# EAGLE design MacroStepper_v3.0 (EAGLE 9.6.2)
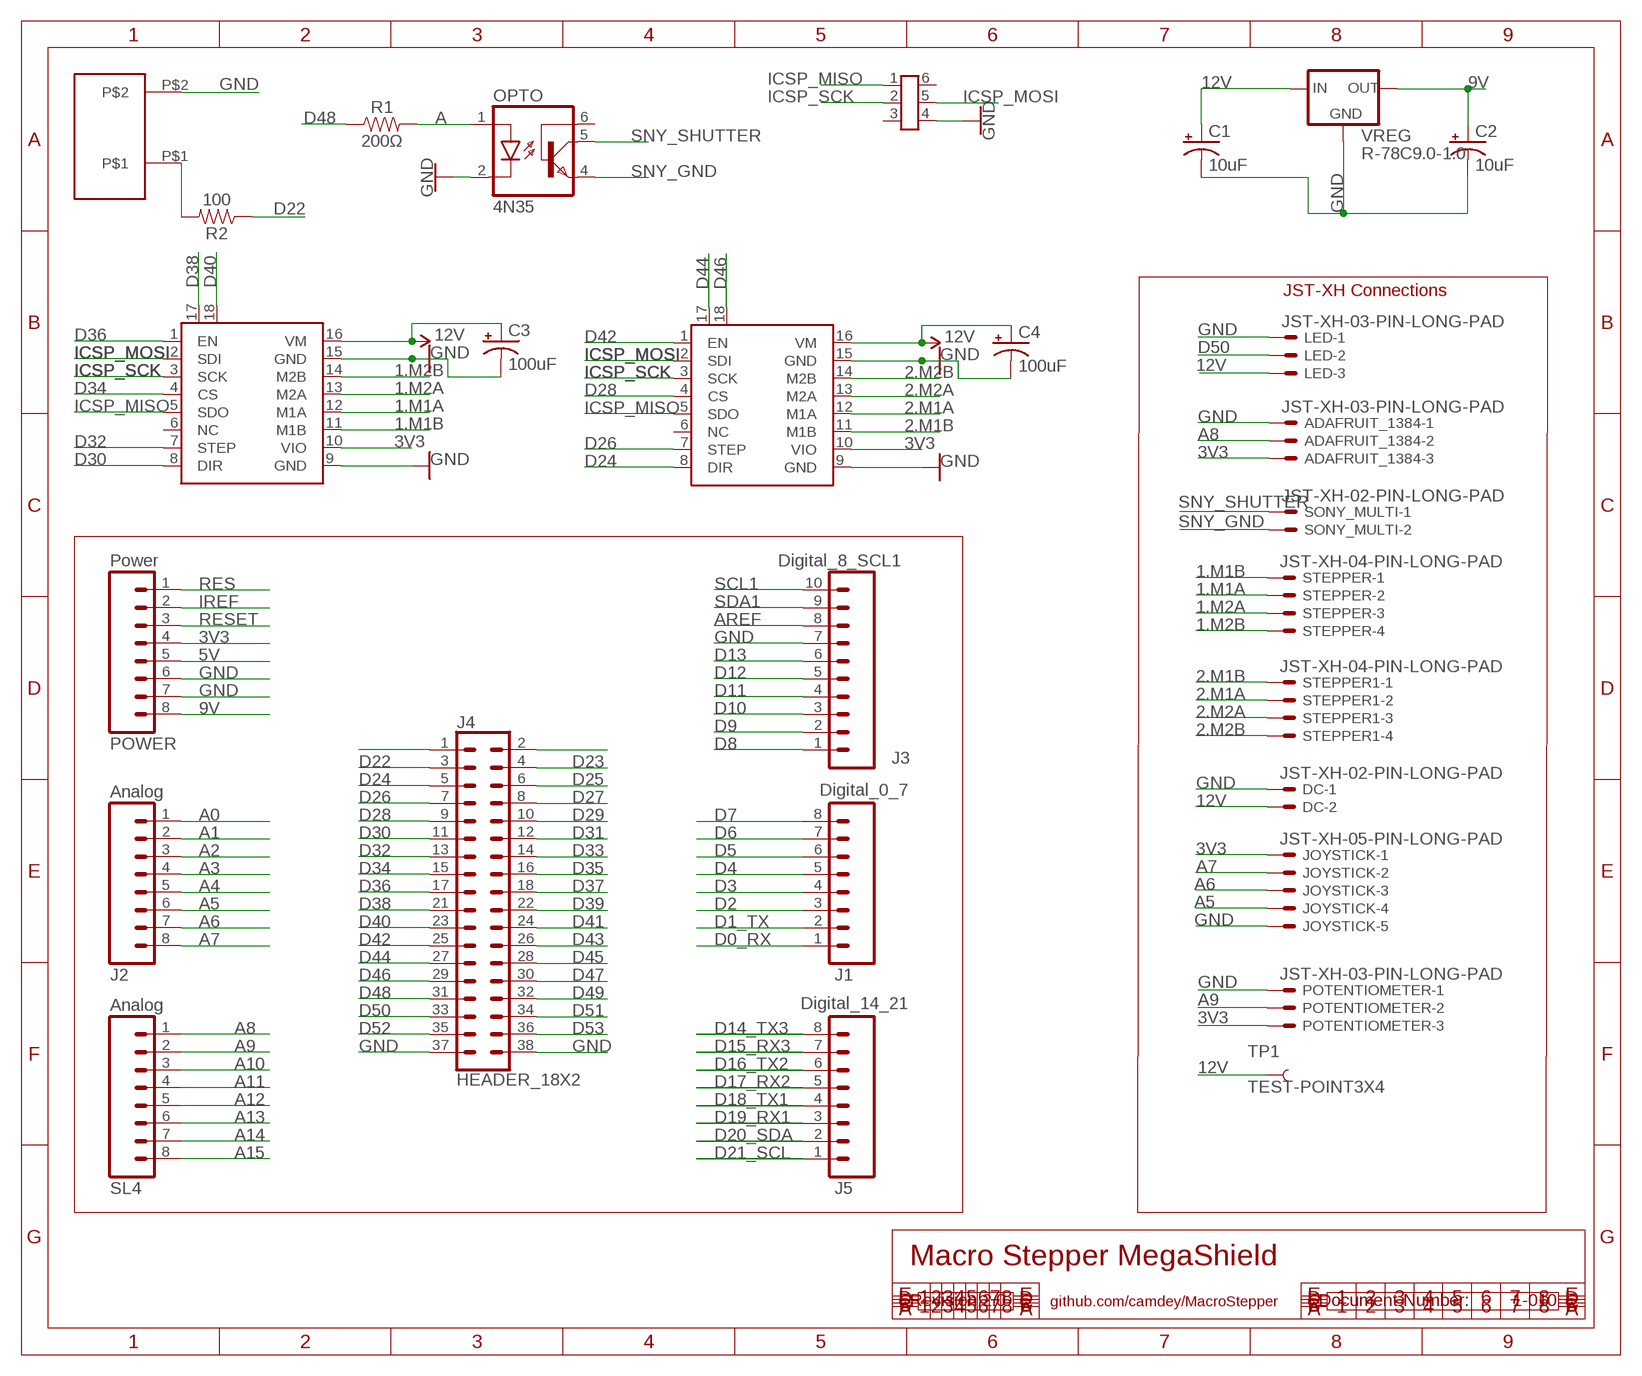
[diagram p0: schematic, sheet 1]

## Parts
ADAFRUIT_1384  JST-XH-03-PIN-LONG-PAD  [JST-XH-03-PACKAGE-LONG-PAD]
C1  10uF  10UF-POLAR-RADIAL-2.5MM-25V-20%  [CPOL-RADIAL-2.5MM-5MM]
C2  10uF  10UF-POLAR-RADIAL-2.5MM-25V-20%  [CPOL-RADIAL-2.5MM-5MM]
C3  100uF  100UF-POLAR-RADIAL-2.5MM-25V-20%  [CPOL-RADIAL-2.5MM-6.5MM]
C4  100uF  100UF-POLAR-RADIAL-2.5MM-25V-20%  [CPOL-RADIAL-2.5MM-6.5MM]
DC  JST-XH-02-PIN-LONG-PAD  [JST-XH-02-PACKAGE-LONG-PAD]
ICSP  MEGA_ICSP  [MEGA_ICSP]
J1  Digital_0_7  M08  [1X08]
J2  Analog  M08  [1X08]
J3  Digital_8_SCL1  M10"  [1X10]
J4  HEADER_18X2  [2X18]
J5  Digital_14_21  M08  [1X08]
JOYSTICK  JST-XH-05-PIN-LONG-PAD  [JST-XH-05-PACKAGE-LONG-PAD]
LED  JST-XH-03-PIN-LONG-PAD  [JST-XH-03-PACKAGE-LONG-PAD]
OPTO  4N35  [DIL06]
PIEZO  PS1240P02BT  [PS1240P02BT]
POTENTIOMETER  JST-XH-03-PIN-LONG-PAD  [JST-XH-03-PACKAGE-LONG-PAD]
POWER  Power  M08  [1X08]
R1  200Ω  RESISTORAXIAL-0.3  [AXIAL-0.3]
R2  100  100OHM-HORIZ-1/4W-1%  [AXIAL-0.3]
SL4  Analog  M08  [1X08]
SONY_MULTI  JST-XH-02-PIN-LONG-PAD  [JST-XH-02-PACKAGE-LONG-PAD]
STEPPER  JST-XH-04-PIN-LONG-PAD  [JST-XH-04-PACKAGE-LONG-PAD]
STEPPER1  JST-XH-04-PIN-LONG-PAD  [JST-XH-04-PACKAGE-LONG-PAD]
TMC5160_1  TMC2130  [DIL16]
TMC5160_2  TMC2130  [DIL16]
TP1  TEST-POINT3X4  [PAD.03X.04]
VREG  R-78C9.0-1.0  [SIP3]

## Nets
1.M1A: STEPPER.2 TMC5160_1.12(M1A)
1.M1B: STEPPER.1 TMC5160_1.11(M1B)
1.M2A: STEPPER.3 TMC5160_1.13(M2A)
1.M2B: STEPPER.4 TMC5160_1.14(M2B)
2.M1A: STEPPER1.2 TMC5160_2.12(M1A)
2.M1B: STEPPER1.1 TMC5160_2.11(M1B)
2.M2A: STEPPER1.3 TMC5160_2.13(M2A)
2.M2B: STEPPER1.4 TMC5160_2.14(M2B)
3V3: ADAFRUIT_1384.3 JOYSTICK.1 POTENTIOMETER.3 POWER.4 TMC5160_1.10(VIO) TMC5160_2.10(VIO)
5V: POWER.5
9V: C2.1(+) POWER.8 VREG.3(OUT)
12V: C1.1(+) C3.1(+) C4.1(+) DC.2 LED.3 TMC5160_1.16(VM) TMC5160_2.16(VM) TP1.P$1 VREG.1(IN)
A: OPTO.1(A) R1.P$2
A0: J2.1
A1: J2.2
A2: J2.3
A3: J2.4
A4: J2.5
A5: J2.6 JOYSTICK.4
A6: J2.7 JOYSTICK.3
A7: J2.8 JOYSTICK.2
A8: ADAFRUIT_1384.2 SL4.1
A9: POTENTIOMETER.2 SL4.2
A10: SL4.3
A11: SL4.4
A12: SL4.5
A13: SL4.6
A14: SL4.7
A15: SL4.8
AREF: J3.8
D0_RX: J1.1
D1_TX: J1.2
D2: J1.3
D3: J1.4
D4: J1.5
D5: J1.6
D6: J1.7
D7: J1.8
D8: J3.1
D9: J3.2
D10: J3.3
D11: J3.4
D12: J3.5
D13: J3.6
D14_TX3: J5.8
D15_RX3: J5.7
D16_TX2: J5.6
D17_RX2: J5.5
D18_TX1: J5.4
D19_RX1: J5.3
D20_SDA: J5.2
D21_SCL: J5.1
D22: J4.3(D22) R2.P$1
D23: J4.4(D23)
D24: J4.5(D24) TMC5160_2.8(DIR)
D25: J4.6(D25)
D26: J4.7(D26) TMC5160_2.7(STEP)
D27: J4.8(D27)
D28: J4.9(D28) TMC5160_2.4(CS)
D29: J4.10(D29)
D30: J4.11(D30) TMC5160_1.8(DIR)
D31: J4.12(D31)
D32: J4.13(D32) TMC5160_1.7(STEP)
D33: J4.14(D33)
D34: J4.15(D34) TMC5160_1.4(CS)
D35: J4.16(D35)
D36: J4.17(D36) TMC5160_1.1(EN)
D37: J4.18(D37)
D38: J4.21(D38) TMC5160_1.17(DIAG0)
D39: J4.22(D39)
D40: J4.23(D40) TMC5160_1.18(DIAG1)
D41: J4.24(D41)
D42: J4.25(D42) TMC5160_2.1(EN)
D43: J4.26(D43)
D44: J4.27(D44) TMC5160_2.17(DIAG0)
D45: J4.28(D45)
D46: J4.29(D46) TMC5160_2.18(DIAG1)
D47: J4.30(D47)
D48: J4.31(D48) R1.P$1
D49: J4.32(D49)
D50: J4.33(D50) LED.2
D51: J4.34(D51)
D52: J4.35(D52)
D53: J4.36(D53)
GND: ADAFRUIT_1384.1 C1.2(-) C2.2(-) C3.2(-) C4.2(-) DC.1 ICSP.4(GND) J3.7 J4.37(GND) J4.38(GND) JOYSTICK.5 LED.1 OPTO.2(C) PIEZO.P$2 POTENTIOMETER.1 POWER.6 POWER.7 TMC5160_1.9(GND) TMC5160_1.15(GND) TMC5160_2.9(GND) TMC5160_2.15(GND) VREG.2(GND)
ICSP_MISO: ICSP.1(MISO) TMC5160_1.5(SDO) TMC5160_2.5(SDO)
ICSP_MOSI: ICSP.5(MOSI) TMC5160_1.2(SDI) TMC5160_2.2(SDI)
ICSP_SCK: ICSP.2(SCK) TMC5160_1.3(SCK) TMC5160_2.3(SCK)
IREF: POWER.2
N$1: J4.1(5V)
N$2: J4.2(5V)
N$3: PIEZO.P$1 R2.P$2
RES: POWER.1
RESET: POWER.3
SCL1: J3.10
SDA1: J3.9
SNY_GND: OPTO.4(EMI) SONY_MULTI.2
SNY_SHUTTER: OPTO.5(COL) SONY_MULTI.1
Unconnected: ICSP.3(RST) ICSP.6(5V) OPTO.6(BAS) TMC5160_1.6(NC) TMC5160_2.6(NC)

## Notes on the sheet
- JST-XH Connections
- Macro Stepper MegaShield
- Revision 2.0 | github.com/camdey/MacroStepper | Document Number: | 1-010

## Library data of the parts
ADAFRUIT_1384 LED POTENTIOMETER = JST XH Connectors v1-0:JST-XH-03-PIN: JST XH Connector 2 Pin Wire to board connector. Pitch: 2,54 mm, (0.100") Number of pins: 3 Created by Rembrandt Electronics www.rembrandtelectronics.com
C1 C2 = SparkFun-Capacitors:10UF-POLAR: 10.0µF polarized capacitors A capacitor is a passive two-terminal electrical component used to store electrical energy temporarily in an electric field.; PROD_ID: CAP-08440
C3 C4 = SparkFun-Capacitors:100UF-POLAR: 100µF polarized capacitors A capacitor is a passive two-terminal electrical component used to store electrical energy temporarily in an electric field.; PROD_ID: CAP-08439
DC SONY_MULTI = JST XH Connectors v1-0:JST-XH-02-PIN: JST XH Connector 2 Pin Wire to board connector. Pitch: 2,54 mm, (0.100") Number of pins: 2 Created by Rembrandt Electronics www.rembrandtelectronics.com
ICSP = my_library:MEGA_ICSP
J1 J2 J5 POWER SL4 = SparkFun:M08: Header 8 Standard 8-pin 0.1" header. Use with straight break away headers (SKU : PRT-00116), right angle break away headers (PRT-00553), swiss pins (PRT-00743), machine pins (PRT-00117), and female headers (PRT-00115).
J3 = SparkFun:M10: Header 10 Standard 10-pin 0.1" header. Use with straight break away headers (SKU : PRT-00116), right angle break away headers (PRT-00553), swiss pins (PRT-00743), machine pins (PRT-00117), and female headers (PRT-00115).
J4 = my_library:HEADER_18X2: Multi connection point. Often used as Generic Header-pin footprint for 0.1 inch spaced/style header connections On any of the 0.1 inch spaced packages, you can populate with these: Break Away Headers - Straight <https://www.sparkfun.com/products/116> (PRT-00116) Break Away Male Headers - Right Angle <https://www.sparkfun.com/products/553> (PRT-00553) Female Headers <https://www.sparkfun.com/products/115> (PRT-00115) Break Away Headers - Machine Pin <https://www.sparkfun.com/products/117> (PRT-00117) Break Away Female Headers - Swiss Machine Pin <https://www.sparkfun.com/products/743> (PRT-00743)
JOYSTICK = JST XH Connectors v1-0:JST-XH-05-PIN: JST XH Connector 2 Pin Wire to board connector. Pitch: 2,54 mm, (0.100") Number of pins: 5 Created by Rembrandt Electronics www.rembrandtelectronics.com
OPTO = optocoupler:4N35: MOTOROLA OPTO COUPLER; MF: FAIRCHILD SEMICONDUCTOR; MPN: 4N35; OC_FARNELL: 1328375; OC_NEWARK: 72K9946
PIEZO = PS1240P02BT:PS1240P02BT; AVAILABILITY: Unavailable; DESCRIPTION: Buzzers Transducer, Externally Driven Piezo 3V 4kHz 60dB @ 3V, 10cm Through Hole PC Pins; MF: TDK; MP: PS1240P02BT; PACKAGE: 2020 TDK; PRICE: None
R1 = SparkFun-Resistors:RESISTOR: Generic Resistor Package
R2 = SparkFun-Resistors:100OHM: 100Ω resistor A resistor is a passive two-terminal electrical component that implements electrical resistance as a circuit element. Resistors act to reduce current flow, and, at the same time, act to lower voltage levels within circuits. - Wikipedia; PROD_ID: RES-12181
STEPPER STEPPER1 = JST XH Connectors v1-0:JST-XH-04-PIN: JST XH Connector 2 Pin Wire to board connector. Pitch: 2,54 mm, (0.100") Number of pins: 4 Created by Rembrandt Electronics www.rembrandtelectronics.com
TMC5160_1 TMC5160_2 = my_library:TMC2130: Pololu stepper driver based on the A4983.
TP1 = SparkFun-Connectors:TEST-POINT: SparkFun Test Points Bare copper test points for troubleshooting or In-Circuit-Testing. These are used by our Production team for verifying production board runs using pogo-pins on test beds. SparkFun Products: SparkFun LSM9DS1 Breakout <https://www.sparkfun.com/products/13284> SparkFun PSOC <https://www.sparkfun.com/products/13714> SparkFun Load Cell Amplifier <https://www.sparkfun.com/products/13879>
VREG = r-78xx_10:R-78C*-1.0: Innoline R-78Cxx-1.0 Series Switching Regulators - 1.0A, Wide Input Range, High Efficiency Source: http://www.recom-international.com/pdf/Innoline/R-78Cxx-1.0.pdf; MF: Recom; MPN: R-78C9.0-1.0; OC_FARNELL: 1903041; OC_NEWARK: 62X9497

## Board
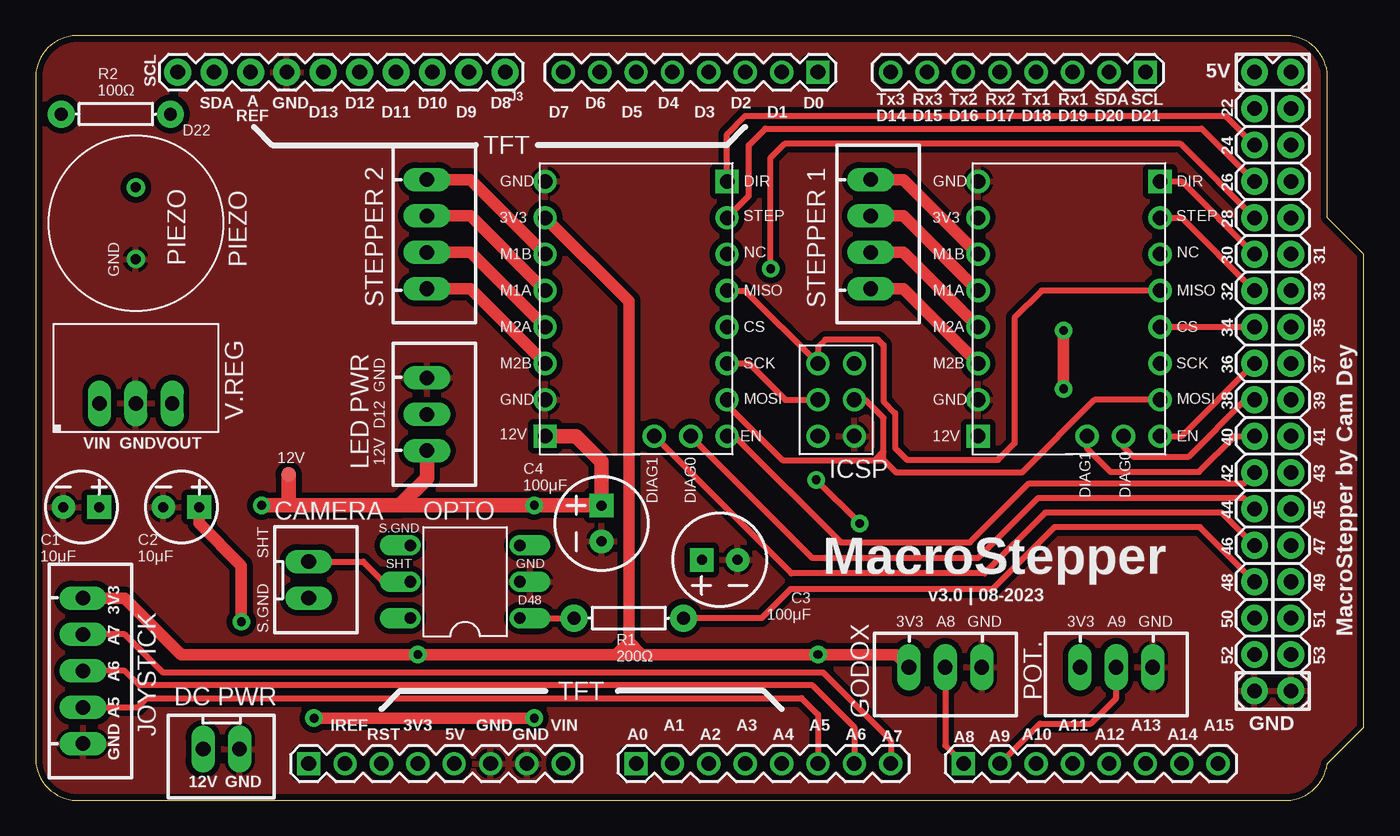
[diagram p1: board, top side]
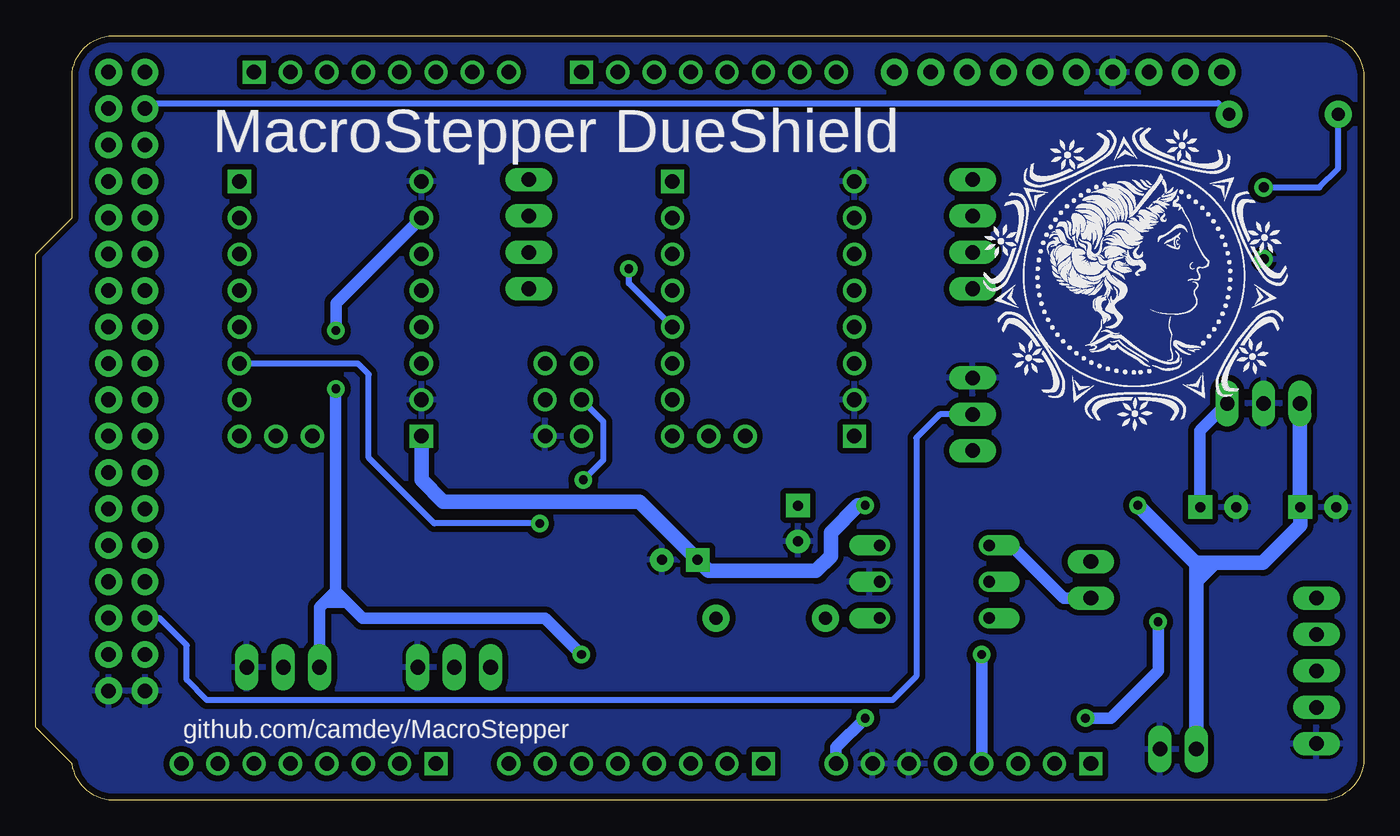
[diagram p2: board, bottom side, seen from below]

Size 92.71 x 53.34 mm. Coordinates in mm from the lower left corner, seen from the top.
Outline: 0,2.54 arc74 2.54,0 87.63,0 arc74 90.17,2.54 92.71,5.08 92.71,38.1 90.17,40.64 90.17,50.8 arc74 87.63,53.34 2.54,53.34 arc74 0,50.8 0,2.54
Copper layers (1*16): Top 0.035mm / dielectric 1.5mm / Bottom 0.035mm
Design rules "default *": minimum track width 10mil, minimum drill 24mil, track to track 16mil, track to pad 16mil, pad to pad 16mil, via to via 16mil, smd to smd 8mil, copper to edge 18mil, drill to drill 8mil, minimum pad ring 12mil, minimum via ring 12mil, stop-mask expansion 4mil, vias tented up to drill 0mil, thermal gap 10mil

### Footprints (pad centres in the part's own frame; a part is rotated, then mirrored left to right if it is on the bottom)
JST-XH-03-PACKAGE-LONG-PAD = drill 1.016 long: 1 -2.54,0; 2 0,0; 3 2.54,0
CPOL-RADIAL-2.5MM-5MM = drill 0.7 pad 1.651 square: 1 1.25,0 | drill 0.7 pad 1.651: 2 -1.25,0
CPOL-RADIAL-2.5MM-6.5MM = drill 0.7 pad 1.651 square: 1 1.25,0 | drill 0.7 pad 1.651: 2 -1.25,0
JST-XH-02-PACKAGE-LONG-PAD = drill 1.016 long: 1 -1.27,0; 2 1.27,0
MEGA_ICSP = drill 1.016: 1 -1.27,2.54; 2 -1.27,0; 3 -1.27,-2.54; 4 1.27,-2.54; 5 1.27,0; 6 1.27,2.54
1X08 = drill 1.016 square: 1 0,0 | drill 1.016: 2 2.54,0; 3 5.08,0; 4 7.62,0; 5 10.16,0; 6 12.7,0; 7 15.24,0; 8 17.78,0
1X10 = drill 1.016 pad 1.88: 1 0,0; 2 2.54,0; 3 5.08,0; 4 7.62,0; 5 10.16,0; 6 12.7,0; 7 15.24,0; 8 17.78,0; 9 20.32,0; 10 22.86,0
2X18 = drill 1.016 pad 1.88: 1 0,0; 2 0,2.54; 3 2.54,0; 4 2.54,2.54; 5 5.08,0; 6 5.08,2.54; 7 7.62,0; 8 7.62,2.54; 9 10.16,0; 10 10.16,2.54; 11 12.7,0; 12 12.7,2.54; 13 15.24,0; 14 15.24,2.54; 15 17.78,0; 16 17.78,2.54; 17 20.32,0; 18 20.32,2.54; 21 22.86,0; 22 22.86,2.54; 23 25.4,0; 24 25.4,2.54; 25 27.94,0; 26 27.94,2.54; 27 30.48,0; 28 30.48,2.54; 29 33.02,0; 30 33.02,2.54; 31 35.56,0; 32 35.56,2.54; 33 38.1,0; 34 38.1,2.54; 35 40.64,0; 36 40.64,2.54; 37 43.18,0; 38 43.18,2.54
JST-XH-05-PACKAGE-LONG-PAD = drill 1.016 long: 1 -5.08,0; 2 -2.54,0; 3 0,0; 4 2.54,0; 5 5.08,0
DIL06 = drill 0.813 offset: 1 -2.54,-3.81; 2 0,-3.81; 3 2.54,-3.81; 4 2.54,3.81; 5 0,3.81; 6 -2.54,3.81
PS1240P02BT = drill 0.7: P$1 -2.5,0; P$2 2.5,0
AXIAL-0.3 = drill 0.9 pad 1.88: P$1 -3.81,0; P$2 3.81,0
JST-XH-04-PACKAGE-LONG-PAD = drill 1.016 long: 1 -3.81,0; 2 -1.27,0; 3 1.27,0; 4 3.81,0
DIL16 = drill 1.016: 1 -6.35,8.89; 2 -6.35,6.35; 3 -6.35,3.81; 4 -6.35,1.27; 5 -6.35,-1.27; 6 -6.35,-3.81; 7 -6.35,-6.35; 9 6.35,-8.89; 10 6.35,-6.35; 11 6.35,-3.81; 12 6.35,-1.27; 13 6.35,1.27; 14 6.35,3.81; 15 6.35,6.35; 17 -3.81,8.89; 18 -1.27,8.89 | drill 1.016 square: 8 -6.35,-8.89; 16 6.35,8.89
PAD.03X.04 = smd 1.016 x 1.016: P$1 0,0
SIP3 = drill 1 long: 1 -2.54,0; 2 0,0; 3 2.54,0

### Placement (x,y rotation side)
ADAFRUIT_1384  63.5,9.27 180 top
C1  3.17,20.45 0 top
C2  10.16,20.45 0 top
C3  47.75,16.76 180 top
C4  39.5,19.3 90 top
DC  12.95,3.56 180 top
ICSP  55.88,27.94 0 top
J1  54.61,50.8 180 top
J2  41.91,2.54 0 top
J3  32.77,50.8 180 top
J4  85.09,50.8 270 top
J5  77.47,50.8 180 top
JOYSTICK  3.3,9.02 270 top
LED  27.3,26.92 270 top
OPTO  29.97,15.24 90 top
PIEZO  6.99,40.26 270 top
POTENTIOMETER  75.44,9.27 180 top
POWER  19.05,2.54 0 top
R1  41.4,12.7 180 top
R2  5.59,47.88 180 top
SL4  64.77,2.54 0 top
SONY_MULTI  19.05,15.37 270 top
STEPPER  58.29,39.5 270 top
STEPPER1  27.3,39.5 270 top
TMC5160_1  72.14,34.29 180 top
TMC5160_2  41.91,34.29 180 top
TP1  17.65,22.73 0 top
U$1  [ARTEMIS_LOGO_LARGE]  26.54,25.4 0 bottom
VREG  6.99,27.69 0 top

### Tracks (layer width: path | path; a pad name or v marks a point on that pad's centre or on a via)
1.M1A
  Top 0.813: STEPPER.2 60.58,40.77 TMC5160_1.12
1.M1B
  Top 0.813: STEPPER.1 60.58,43.31 TMC5160_1.11
1.M2A
  Top 0.813: STEPPER.3 60.58,38.23 TMC5160_1.13
1.M2B
  Top 0.813: STEPPER.4 60.58,35.69 TMC5160_1.14
2.M1A
  Top 0.813: STEPPER1.2 30.35,40.77 TMC5160_2.12
2.M1B
  Top 0.813: STEPPER1.1 30.35,43.31 TMC5160_2.11
2.M2A
  Top 0.813: STEPPER1.3 30.35,38.23 TMC5160_2.13
2.M2B
  Top 0.813: STEPPER1.4 30.35,35.69 TMC5160_2.14
3V3  (via drill 0.61)
  Top 0.813: 42.29,10.16 41.4,10.16 | 41.4,10.16 40.51,10.16 | 40.51,10.16 v26.67,10.16 10.16,10.16 6.22,14.1 JOYSTICK.1 | v71.75,32.77 v71.75,28.7 | TMC5160_2.10 41.4,34.8 41.4,11.05 | 41.4,11.05 41.4,10.16 | 40.51,10.16 41.4,11.05 | 41.4,11.05 42.29,10.16 | 42.29,10.16 v54.61,10.16 60.07,10.16 ADAFRUIT_1384.3
  Bottom 0.813: v26.67,10.16 POWER.4 | TMC5160_1.10 71.75,34.67 v71.75,32.77 | v71.75,28.7 71.78,28.68 71.78,14.59 | v54.61,10.16 57.15,12.7 69.89,12.7 71.01,13.82 | 71.78,14.59 72.55,13.82 | POTENTIOMETER.3 72.9,13.47 72.55,13.82 | 71.01,13.82 71.78,14.59 | 71.01,13.82 72.55,13.82
9V  (via drill 0.61)
  Top 0.813: v34.8,5.71 v19.43,5.71 | C2.1 11.41,19.3 14.35,16.36 v14.35,12.45
  Bottom 0.813: VREG.3 11.43,25.78 11.43,20.47 C2.1 | v19.43,5.71 17.65,5.71 14.35,9.02 v14.35,12.45 | v34.8,5.71 36.83,3.68 POWER.8
12V  (via drill 0.61)
  Top 1.016: v15.77,20.57 17.65,20.57 | 17.65,20.57 25.4,20.57 | 25.4,20.57 27.3,22.48 LED.3 | 25.4,20.57 v34.8,20.57 39.48,20.57 C4.1 39.5,23.62 37.72,25.4 TMC5160_2.16 | TP1.P$1 17.65,20.57
  Bottom 1.016: VREG.1 4.45,20.47 C1.1 4.42,19.18 7.04,16.56 10.41,16.56 | 11.76,16.56 v15.77,20.57 | 10.41,16.56 11.76,16.56 | DC.2 11.68,15.29 | 11.68,15.29 11.68,16.49 11.76,16.56 | 10.41,16.56 11.68,15.29 | v34.8,20.57 35.31,20.57 37.21,18.67 37.21,17.02 38.23,16 45.74,16 C3.1 50.57,20.83 64.26,20.83 65.79,22.35 TMC5160_1.16
A
  Top 0.406: OPTO.1 R1.P$2
A5
  Top 0.406: J2.6 54.61,5.97 53.47,7.11 7.75,7.11 7.11,6.48 JOYSTICK.4
A6
  Top 0.406: J2.7 57.15,5.08 54.23,8 7.24,8 6.22,9.02 JOYSTICK.3
A7
  Top 0.406: J2.8 59.69,4.19 54.99,8.89 8.89,8.89 6.22,11.56 JOYSTICK.2
A8
  Top 0.406: ADAFRUIT_1384.2 63.5,3.81 SL4.1
A9
  Top 0.406: SL4.2 70.1,5.33 73.66,5.33 75.44,7.11 POTENTIOMETER.2
D22
  Bottom 0.406: J4.3 84.71,48.64 10.16,48.64 R2.P$1
D24
  Top 0.406: TMC5160_2.8 48.26,46.48 49.53,47.75 83.06,47.75 J4.5
D26
  Top 0.406: TMC5160_2.7 49.78,42.16 49.78,45.72 50.93,46.86 81.41,46.86 J4.7
D28  (via drill 0.61)
  Top 0.406: v51.31,37.08 51.31,44.83 52.27,45.8 79.93,45.8 J4.9
  Bottom 0.406: TMC5160_2.4 51.31,36.07 v51.31,37.08
D30
  Top 0.406: TMC5160_1.8 80.01,43.18 J4.11
D32
  Top 0.406: TMC5160_1.7 80.01,40.64 J4.13
D34
  Top 0.406: TMC5160_1.4 J4.15
D36
  Top 0.406: TMC5160_1.1 80.01,25.4 J4.17
D38
  Top 0.406: TMC5160_1.17 75.95,24.66 76.63,23.98 80.49,23.98 84.45,27.94 J4.21
D40
  Top 0.406: J4.23 83.7,25.4 81.21,22.91 75.03,22.91 73.41,24.53 TMC5160_1.18
D42
  Top 0.406: TMC5160_2.1 48.78,25.4 56.2,17.98 65.23,17.98 69.34,22.1 84.34,22.1 85.09,22.85 J4.25
D44
  Top 0.406: TMC5160_2.17 54.23,16.89 65.79,16.89 69.98,21.08 84.33,21.08 J4.27
D46
  Top 0.406: TMC5160_2.18 52.76,15.82 66.24,15.82 70.48,20.07 82.8,20.07 J4.29
D48
  Top 0.406: J4.31 81.28,19.05 71.12,19.05 66.8,14.73 52.7,14.73 50.67,12.7 R1.P$1
D50
  Bottom 0.406: LED.2 29.59,26.92 31.24,25.27 31.24,8.64 32.89,6.99 80.77,6.99 82.17,8.38 82.17,10.79 84.07,12.7 J4.33
GND
  pour Bottom (isolate 0.406): 0,50.8 arc-74 2.54,53.34 87.63,53.34 arc-74 90.17,50.8 90.17,40.64 92.71,38.1 92.71,5.08 90.17,2.54 arc-74 87.63,0 2.54,0 arc-90 0,2.54
  pour Top (isolate 0.406): 0,50.8 arc-74 2.54,53.34 87.63,53.34 arc-74 90.17,50.8 90.17,40.64 92.71,38.1 92.71,5.08 90.17,2.54 arc-74 87.63,0 2.54,0 arc-74 0,2.54
ICSP_MISO
  Top 0.406: TMC5160_2.5 49.53,35.56 ICSP.1 54.61,31.62 55.12,32.13 58.8,32.13 59.18,31.75 59.18,27.82 59.99,27.01 59.99,24.59 60.83,23.75 67.18,23.75 68.33,24.89 68.33,33.66 70.23,35.56 TMC5160_1.5
ICSP_MOSI
  Top 0.406: 58.57,23.72 52.12,23.72 48.26,27.58 TMC5160_2.2 | 59.18,24.33 58.57,23.72 | 59.18,24.33 59.18,26.67 57.91,27.94 ICSP.5 | TMC5160_1.2 73.91,27.94 68.83,22.86 60.07,22.86 59.18,23.75 | 59.18,23.75 59.18,24.33 | 58.57,23.72 59.16,23.72 59.18,23.75
ICSP_SCK  (via drill 0.61)
  Top 0.406: TMC5160_2.3 49.78,30.48 52.32,27.94 ICSP.2 | v57.53,19.3 v54.48,22.35
  Bottom 0.406: v54.48,22.35 53.09,23.75 53.09,26.42 ICSP.2 | TMC5160_1.3 70.23,30.48 69.47,29.72 69.47,23.88 64.9,19.3 v57.53,19.3
N$3
  Bottom 0.406: PIEZO.P$1 3.09,42.76 1.78,44.07 R2.P$2
SNY_GND
  Bottom 0.813: OPTO.4 24.62,17.78 20.93,14.1 SONY_MULTI.2
SNY_SHUTTER
  Top 0.406: SONY_MULTI.1 22.86,16.64 24.26,15.24 OPTO.5

### Text on the board
tPlace: SCL | 5V | R2 / 100Ω | Tx3 | Rx3 | Tx2 | Rx2 | Tx1 | Rx1 | SDA | SCL | 22 | SDA | A | GND | D13 | D12 | D11 | D10 | D9 | D8 | D7 | D6 | D5 | D4 | D3 | D2 | D1 | D0 | REF | D14 | D15 | D16 | D17 | D18 | D19 | D20 | D21 | D22 | TFT | 24 | GND | DIR | GND | DIR | 26 | 3V3 | STEP | 3V3 | STEP | 28 | GND | M1B | NC | M1B | NC | PIEZO | 30 | 31 | M1A | MISO | M1A | MISO | 32 | 33 | STEPPER 2 | STEPPER 1 | M2A | CS | M2A | CS | 34 | 35 | M2B | SCK | M2B | SCK | 36 | 37 | GND | GND | MOSI | GND | MOSI | V.REG | 38 | 39 | D12 | VIN | GND | VOUT | 12V | EN | 12V | EN | 40 | 41 | 12V | LED PWR | 12V | C4 / 100μF | ICSP | 42 | 43 | DIAG1 | DIAG0 | DIAG1 | DIAG0 | CAMERA | OPTO | 44 | 45 | S.GND | C1 / 10μF | C2 / 10μF | SHT | SHT | 46 | 47 | GND | MacroStepper | 48 | 49 | D48 | C3 / 100μF | v3.0 | 08-2023 | 3V3 | S.GND | 3V3 | A8 | GND | 3V3 | A9 | GND | 50 | 51 | A7 | MacroStepper by Cam Dey | R1 / 200Ω | 52 | 53 | A6 | DC PWR | TFT | POT. | A5 | GODOX | GND | IREF | 3V3 | GND | VIN | A1 | A3 | A5 | A8 | A11 | A13 | A15 | JOYSTICK | RST | 5V | GND | A0 | A2 | A4 | A6 | A7 | A9 | A10 | A12 | A14 | GND | 12V | GND
bPlace: MacroStepper DueShield | github.com/camdey/MacroStepper